# Altium project LimeNet-Micro_2v0.PrjPcb (part 7 of 9)

## Sheet 14_Clocks.SchDoc: Clocks
size A3; Organization: Lime Microsystems; Address1: Surrey Tech Centre; Address2: Guildford GU2 7YG; Address3: Surrey; Address4: United Kingdom; Revision: v2.0; SheetNumber: 14; SheetTotal: 15
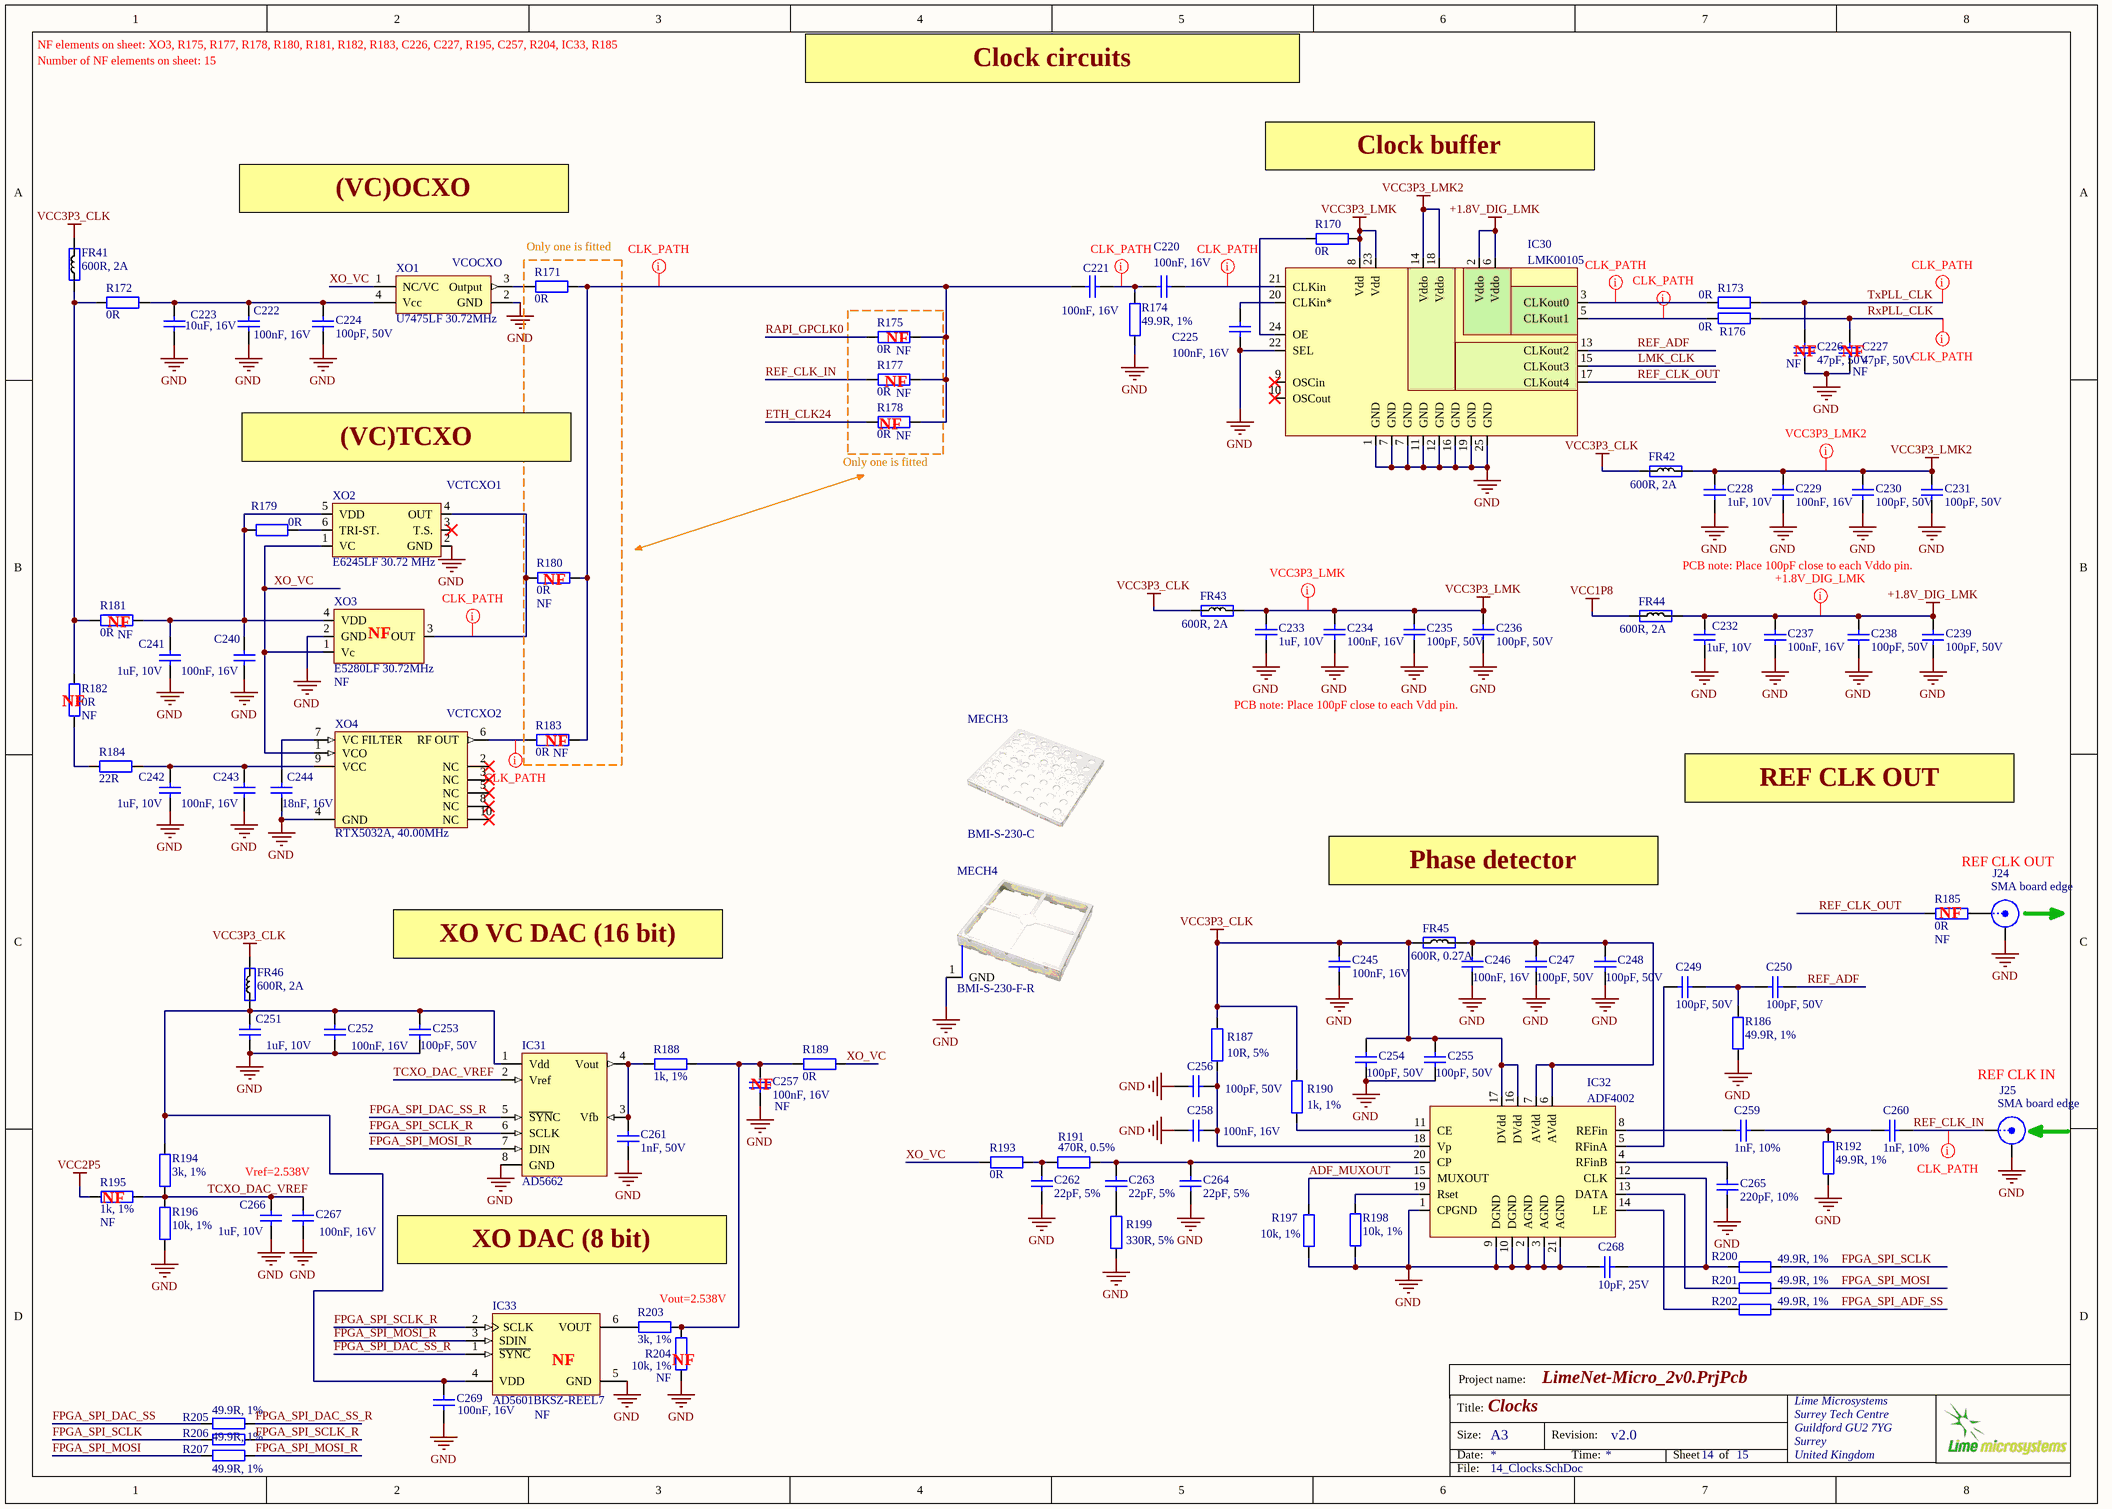
[diagram p13: 14_Clocks.SchDoc]

### Parts
C220  100nF, 16V  [CAP0402]
C221  100nF, 16V  [CAP0402]
C222  100nF, 16V  [CAP0402]
C223  10uF, 16V  [CAP0603]
C224  100pF, 50V  [CAP0402]
C225  100nF, 16V  [CAP0402]
C226  47pF, 50V  Assembly Info: NF  [CAP0402]
C227  47pF, 50V  Assembly Info: NF  [CAP0402]
C228  1uF, 10V  [CAP0402]
C229  100nF, 16V  [CAP0402]
C230  100pF, 50V  [CAP0402]
C231  100pF, 50V  [CAP0402]
C232  1uF, 10V  [CAP0402]
C233  1uF, 10V  [CAP0402]
C234  100nF, 16V  [CAP0402]
C235  100pF, 50V  [CAP0402]
C236  100pF, 50V  [CAP0402]
C237  100nF, 16V  [CAP0402]
C238  100pF, 50V  [CAP0402]
C239  100pF, 50V  [CAP0402]
C240  100nF, 16V  [CAP0402]
C241  1uF, 10V  [CAP0402]
C242  1uF, 10V  [CAP0402]
C243  100nF, 16V  [CAP0402]
C244  18nF, 16V  [CAP0402]
C245  100nF, 16V  [CAP0402]
C246  100nF, 16V  [CAP0402]
C247  100pF, 50V  [CAP0402]
C248  100pF, 50V  [CAP0402]
C249  100pF, 50V  [CAP0402]
C250  100pF, 50V  [CAP0402]
C251  1uF, 10V  [CAP0402]
C252  100nF, 16V  [CAP0402]
C253  100pF, 50V  [CAP0402]
C254  100pF, 50V  [CAP0402]
C255  100pF, 50V  [CAP0402]
C256  100pF, 50V  [CAP0402]
C257  100nF, 16V  Assembly Info: NF  [CAP0402]
C258  100nF, 16V  [CAP0402]
C259  1nF, 10%  [CAP0402]
C260  1nF, 10%  [CAP0402]
C261  1nF, 50V  [CAP0402]
C262  22pF, 5%  [CAP0402]
C263  22pF, 5%  [CAP0402]
C264  22pF, 5%  [CAP0402]
C265  220pF, 10%  [CAP0402]
C266  1uF, 10V  [CAP0402]
C267  100nF, 16V  [CAP0402]
C268  10pF, 25V  [CAP0402]
C269  100nF, 16V  [CAP0402]
FR41  600R, 2A  [RES0805]
FR42  600R, 2A  [RES0805]
FR43  600R, 2A  [RES0805]
FR44  600R, 2A  [RES0805]
FR45  600R, 0.27A  [RES0201]
FR46  600R, 2A  [RES0805]
IC30  LMK00105  [LMK00105SQ]
IC31  AD5662  [AD5662_SOT23-8]
IC32  ADF4002  [ADF4002]
IC33  AD5601BKSZ-REEL7  Assembly Info: NF  [AD5601_SOT23-6]
J24  SMA board edge  [SMA_connector_board_edge_SM]
J25  SMA board edge  [SMA_connector_board_edge_SM]
MECH3  BMI-S-230-C  (mechanical)
MECH4  BMI-S-230-F-R  [RFI_SHIELD_BMI-S-230-F-R]
R170  0R  [RES0402]
R171  0R  [RES0402_v2]
R172  0R  [RES0402]
R173  0R  [RES0402]
R174  49.9R, 1%  [RES0402]
R175  0R  Assembly Info: NF  [RES0402_v2]
R176  0R  [RES0402]
R177  0R  Assembly Info: NF  [RES0402_v2]
R178  0R  Assembly Info: NF  [RES0402_v2]
R179  0R  [RES0402]
R180  0R  Assembly Info: NF  [RES0402_v2]
R181  0R  Assembly Info: NF  [RES0402]
R182  0R  Assembly Info: NF  [RES0402]
R183  0R  Assembly Info: NF  [RES0402_v2]
R184  22R  [RES0402]
R185  0R  Assembly Info: NF  [RES0402]
R186  49.9R, 1%  [RES0402]
R187  10R, 5%  [RES0402]
R188  1k, 1%  [RES0402]
R189  0R  [RES0402]
R190  1k, 1%  [RES0402]
R191  470R, 0.5%  [RES0402]
R192  49.9R, 1%  [RES0402]
R193  0R  [RES0402]
R194  3k, 1%  [RES0402]
R195  1k, 1%  Assembly Info: NF  [RES0402]
R196  10k, 1%  [RES0402]
R197  10k, 1%  [RES0402]
R198  10k, 1%  [RES0402]
R199  330R, 5%  [RES0402]
R200  49.9R, 1%  [RES0402]
R201  49.9R, 1%  [RES0402]
R202  49.9R, 1%  [RES0402]
R203  3k, 1%  [RES0402]
R204  10k, 1%  Assembly Info: NF  [RES0402]
R205  49.9R, 1%  [RES0402]
R206  49.9R, 1%  [RES0402]
R207  49.9R, 1%  [RES0402]
XO1  U7475LF 30.72MHz  [AOCJYR-10.000MHz]
XO2  E6245LF 30.72 MHz  [RAKON_RPT7050A]
XO3  E5280LF 30.72MHz  Assembly Info: NF  [RAKON_TXCO]
XO4  RTX5032A, 40.00MHz  [RAKON_RTX5032A]

### Blocks framed on the sheet
Only one is fitted: R171 R180 R183

### Nets
+1.8V_DIG_LMK: C232.2 C237.2 C238.2 C239.2 FR44.2 IC30.2(Vddo) IC30.6(Vddo)
GND: C222.1 C223.1 C224.2 C225.1 C226.1 C227.1 C228.1 C229.1 C230.1 C231.1 C232.1 C233.1 C234.1 C235.1 C236.1 C237.1 C238.1 C239.1 C240.1 C241.1 C242.1 C243.1 C244.1 C245.1 C246.1 C247.2 C248.2 C251.1 C252.2 C253.2 C254.2 C255.2 C256.1 C257.1 C258.2 C261.2 C262.1 C264.1 C265.2 C266.1 C267.2 C268.1 C269.2 IC30.1(GND) IC30.7(GND) IC30.11(GND) IC30.12(GND) IC30.16(GND) IC30.19(GND) IC30.22(SEL) IC30.25(GND) IC31.8(GND) IC32.1(CPGND) IC32.2(AGND) IC32.3(AGND) IC32.9(DGND) IC32.10(DGND) IC32.21(AGND) IC33.5(GND) J24.2(Y) J25.2(Y) MECH4.1(GND) R174.1 R186.1 R192.1 R196.2 R197.2 R198.2 R199.1 R204.2 XO1.2(GND) XO2.2(GND) XO3.2(GND) XO4.4(GND)
VCC1P8: FR44.1
VCC2P5: R195.2
VCC3P3_CLK: C245.2 C254.1 C255.1 FR41.1 FR42.1 FR43.1 FR45.1 FR46.2 IC32.16(DVdd) IC32.17(DVdd) R187.2 R190.2
VCC3P3_LMK: C233.2 C234.2 C235.2 C236.2 FR43.2 IC30.8(Vdd) IC30.23(Vdd) R170.2
VCC3P3_LMK2: C228.2 C229.2 C230.2 C231.2 FR42.2 IC30.14(Vddo) IC30.18(Vddo)
ADF_MUXOUT: IC32.15(MUXOUT) R197.1
ETH_CLK24: R178.2
FPGA_SPI_ADF_SS: R202.1
FPGA_SPI_DAC_SS: R205.2
FPGA_SPI_DAC_SS_R: IC31.5(~{SYN}C) IC33.1(~{SYNC}) R205.1
FPGA_SPI_MOSI: R201.1 R207.2
FPGA_SPI_MOSI_R: IC31.7(DIN) IC33.3(SDIN) R207.1
FPGA_SPI_SCLK: R200.1 R206.2
FPGA_SPI_SCLK_R: IC31.6(SCLK) IC33.2(SCLK) R206.1
LMK_CLK: IC30.15(CLKout3)
RAPI_GPCLK0: R175.2
REF_ADF: C250.2 IC30.13(CLKout2)
REF_CLK_IN: C260.1 J25.1(X) R177.2
REF_CLK_OUT: IC30.17(CLKout4) R185.2
RxPLL_CLK: C227.2 R176.1
TCXO_DAC_VREF: C266.2 C267.1 IC31.2(Vref) R194.1 R195.1 R196.1
TxPLL_CLK: C226.2 R173.1
XO_VC: R189.1 R193.2 XO1.1(NC/VC) XO2.1(VC) XO3.1(Vc) XO4.1(VCO)
NetC220_1: C220.1 IC30.21(CLKin)
NetC220_2: C220.2 C221.1 R174.2
NetC221_2: C221.2 R171.1 R175.1 R177.1 R178.1 R180.1 R183.2
NetC222_2: C222.2 C223.2 C224.1 R172.2 XO1.4(Vcc)
NetC225_2: C225.2 IC30.20(CLKin*)
NetC240_2: C240.2 C241.2 R179.2 R181.1 XO2.5(VDD) XO3.4(VDD)
NetC242_2: C242.2 C243.2 R184.2 XO4.9(VCC)
NetC244_2: C244.2 XO4.7(VC_FILTER)
NetC246_2: C246.2 C247.1 C248.1 FR45.2 IC32.6(AVdd) IC32.7(AVdd)
NetC249_1: C249.1 IC32.5(RFinA)
NetC249_2: C249.2 C250.1 R186.2
NetC251_2: C251.2 C252.1 C253.1 C269.1 FR46.1 IC31.1(Vdd) IC33.4(VDD) R194.2
NetC256_2: C256.2 C258.1 IC32.18(Vp) R187.1
NetC257_2: C257.2 R188.1 R189.2 R203.1 R204.1
NetC259_1: C259.1 C260.2 R192.2
NetC259_2: C259.2 IC32.8(REFin)
NetC261_1: C261.1 IC31.3(Vfb) IC31.4(Vout) R188.2
NetC262_2: C262.2 R191.2 R193.1
NetC263_1: C263.1 R199.2
NetC263_2: C263.2 C264.2 IC32.20(CP) R191.1
NetC265_1: C265.1 IC32.4(RFinB)
NetC268_2: C268.2 IC32.12(CLK) R200.2
NetFR41_2: FR41.2 R172.1 R181.2 R182.1
NetIC30_3: IC30.3(CLKout0) R173.2
NetIC30_5: IC30.5(CLKout1) R176.2
NetIC30_24: IC30.24(OE) R170.1
NetIC32_11: IC32.11(CE) R190.1
NetIC32_13: IC32.13(DATA) R201.2
NetIC32_14: IC32.14(LE) R202.2
NetIC32_19: IC32.19(Rset) R198.1
NetIC33_6: IC33.6(VOUT) R203.2
NetJ24_1: J24.1(X) R185.1
NetR171_2: R171.2 XO1.3(Output)
NetR179_1: R179.1 XO2.6(TRI-ST.)
NetR180_2: R180.2 XO2.4(OUT) XO3.3(OUT)
NetR182_2: R182.2 R184.1
NetR183_1: R183.1 XO4.6(RF_OUT)

Not connected (* = marked no-connect by the designer): IC30 9(OSCin)* 10(OSCout)*; XO2 3(T.S.)*; XO4 2(NC)* 3(NC)* 5(NC)* 8(NC)* 10(NC)*

### Layout directives
net class CLK_PATH: NetC220_1, NetC220_2, NetC221_2, NetIC30_3, NetIC30_5, NetR180_2, NetR183_1, REF_CLK_IN, RxPLL_CLK, TxPLL_CLK
net class VCC3P3_LMK2: VCC3P3_LMK2
net class VCC3P3_LMK: VCC3P3_LMK
net class +1.8V_DIG_LMK: +1.8V_DIG_LMK

### Notes on the sheet
- NF elements on sheet: XO3, R175, R177, R178, R180, R181, R182, R183, C226, C227, R195, C257, R204, IC33, R185
- Number of NF elements on sheet: 15
- Clock circuits
- Clock buffer
- (VC)OCXO
- (near XO1) VCOCXO
- (near R175) NF
- (near C226) NF
- (near C227) NF
- (near R178) NF
- (near R177) NF
- (VC)TCXO
- (near XO2) VCTCXO1
- (near R178) Only one is fitted
- (near R180) NF
- PCB note: Place 100pF close to each Vddo pin.
- (near R181) NF
- (near XO3) NF
- (near R182) NF
- (near XO4) VCTCXO2
- PCB note: Place 100pF close to each Vdd pin.
- (near R183) NF
- REF CLK OUT
- Phase detector
- (near R185) NF
- XO VC DAC (16 bit)
- (near C257) NF
- (near J25) REF CLK IN
- Vref=2.538V
- (near R195) NF
- XO DAC (8 bit)
- Vout=2.538V
- (near IC33) NF
- (near R204) NF
- Project name:
- Title:
- Size:
- Date:
- A3
- Revision:
- Time:
- Sheet
- of
- File:

### Library data of the parts
C220-C222 C225 C229 C234 C237 C240 C243 C245 C246 C257 C258 = Cap_0402: Manufacturer: Murata Electronics; Manufacturer Part Number: GRM155R71C104KA88D; Part Description: CAP CER 0.1UF 16V X7R 0402; Tolerance: 10 %; Type: General Purpose MLCC; Capacitance: 0.1 uF; Case Length: 1 mm; Dielectric: X7R; Case Height: 0.5 mm; Temperature Coefficient / Code: +/- 15 %; Value: 100nF, 16V; Supplier 1: Mouser; Supplier Part Number 1: 81-GRM155R71C104KA88; Case Code - in: 0402; RoHS: RoHS Compliant; Operating Temperature Range: - 55 C to + 125 C; Series: GRM; Termination Style: SMD/SMT; Package / Case: 0402 (1005 metric); Voltage Rating DC: 16 V; Maximum Operating Temperature: + 125 C; Case Code - mm: 1005; Minimum Operating Temperature: - 55 C; Product Category: Low & Medium Capacitance SMD Ceramic Chip Capacitors; Packaging: Reel; Product: General Type MLCCs; Category: Multilayer Ceramic Capacitors MLCC - SMD/SMT; Brand: Murata Electronics; Case Width: 0.5 mm; RoHS - Mouser: Y; Standard Pack Qty: 10000; Minimum Order Quantity: 1; Reeling: True; Manufacturer Part Number 1: GRM155R71C104KA88D
C223 = Cap_0603: Manufacturer: Yageo; Manufacturer Part Number 1: GRM188R61C106MA73D; Part Description: 10µF ±20% 16V Ceramic Capacitor X5R 0603 (1608 Metric); Temperature Coefficient: X5R; Capacitance: 10µF; Tolerance: ±20%; Value: 10uF, 16V; Supplier 1: Digi-Key; Supplier Part Number 1: 490-7201-2-ND; Category: Capacitors; Ratings: -; Features: -; Lead Style: -; Package / Case: 0603 (1608 Metric); Lead Spacing: -; Applications: General Purpose; Voltage - Rated: 16V; Operating Temperature: -55°C ~ 85°C; Thickness (Max): 0.039" (1.00mm); Mounting Type: Surface Mount, MLCC; RoHS: RoHS Compliant; Size / Dimension: 0.063" L x 0.031" W (1.60mm x 0.80mm); Packaging: Tape & Reel (TR); Height - Seated (Max): -
C224 = Cap_0402: Manufacturer Part Number 1: CC0402JRNPO9BN101; Manufacturer: Yageo; Part Description: 100pF ±5% 50V C0G, NP0 Ceramic Capacitor -55°C ~ 125°C Surface Mount, MLCC 0402 (1005 Metric) 0.039" L x 0.020" W (1.00mm x 0.50mm); Tolerance: ±5%; Temperature Coefficient: C0G, NP0; Value: 100pF, 50V; Capacitance: 100pF; Thickness (Max): 0.022" (0.55mm); Size / Dimension: 0.039" L x 0.020" W (1.00mm x 0.50mm); RoHS: RoHS Compliant; Ratings: -; Package / Case: 0402 (1005 Metric); Mounting Type: Surface Mount, MLCC; Height - Seated (Max): -; Features: -; Lead Spacing: -; Voltage - Rated: 50V; Operating Temperature: -55°C ~ 125°C; Packaging: Cut Tape (CT); Applications: General Purpose; Lead Style: -; Supplier 1: Digi-Key; Category: Capacitors; Supplier Part Number 1: 311-1024-1-ND
C226 C227 = Cap_0402: Manufacturer Part Number 1: C1005C0G1H470F050BA; Manufacturer: TDK Corporation; Part Description: 47pF ±1% 50V C0G, NP0 Ceramic Capacitor -55°C ~ 125°C Surface Mount, MLCC 0402 (1005 Metric) 0.039" L x 0.020" W (1.00mm x 0.50mm); Temperature Coefficient: C0G, NP0; Tolerance: ±1%; Value: 47pF, 50V; Supplier 1: Digi-Key; Supplier Part Number 1: 445-5361-1-ND; Package / Case: 0402 (1005 Metric); Voltage - Rated: 50V; Lead Spacing: -; Ratings: -; Mounting Type: Surface Mount, MLCC; Operating Temperature: -55°C ~ 125°C; Thickness (Max): 0.022" (0.55mm); Capacitance: 47pF; Packaging: Cut Tape (CT); Features: -; Applications: General Purpose; Lead Style: -; Size / Dimension: 0.039" L x 0.020" W (1.00mm x 0.50mm); Height - Seated (Max): -; RoHS: RoHS Compliant; Category: Capacitors
C228 C232 C233 C241 C242 C251 C266 = Cap_0402: CAP CER 1UF 10V X5R 0402; Manufacturer: Yageo; Part Description: 1µF 10V Ceramic Capacitor X5R 0402 (1005 Metric) 0.039" L x 0.020" W (1.00mm x 0.50mm); Manufacturer Part Number: CC0402MRX5R6BB105; Notification: Current market demand for these product types have resulted in fluctuating and extending lead times. Lead times may differ.; Tolerance: ±20%; Value: 1uF, 10V; Supplier 1: Digi-Key; Supplier Part Number 1: 311-1732-1-ND; RoHS: RoHS Compliant; Applications: General Purpose; Category: Capacitors; ComponentLink1Description: http://www.yageo.com/documents/recent/UPY-GPHC_X5R_4V-to-50V_25.pdf; ComponentLink1URL: http://www.yageo.com/documents/recent/UPY-GPHC_X5R_4V-to-50V_25.pdf; Failure Rate: -; Features: -; Height - Seated (Max): -; Lead Spacing: -; Lead Style: -; Mounting Type: Surface Mount, MLCC; Operating Temperature: -55°C ~ 85°C; Package / Case: 0402 (1005 Metric); Packaging: Cut Tape (CT); Part Status: Active; Pricing 1: 1=0.22, 10=0.156, 100=0.0732, 500=0.0513, 1000=0.04248, 2500=0.03953, 5000=0.03617 (USD); Ratings: -; Size / Dimension: 0.039" L x 0.020" W (1.00mm x 0.50mm); Stock 1: 69600; Temperature Coefficient: X5R; Thickness (Max): 0.022" (0.55mm); Voltage - Rated: 10V
C230 C231 C235 C236 C238 C239 = Cap_0402: Manufacturer Part Number 1: CC0402JRNPO9BN101; Manufacturer: Yageo; Part Description: 100pF ±5% 50V C0G, NP0 Ceramic Capacitor -55°C ~ 125°C Surface Mount, MLCC 0402 (1005 Metric) 0.039" L x 0.020" W (1.00mm x 0.50mm); Temperature Coefficient: C0G, NP0; Tolerance: ±5%; Value: 100pF, 50V; Supplier 1: Digi-Key; Supplier Part Number 1: 311-1024-1-ND; RoHS: RoHS Compliant; Category: Capacitors; Applications: General Purpose; Mounting Type: Surface Mount, MLCC; Capacitance: 100pF; Ratings: -; Packaging: Cut Tape (CT); Voltage - Rated: 50V; Size / Dimension: 0.039" L x 0.020" W (1.00mm x 0.50mm); Height - Seated (Max): -; Package / Case: 0402 (1005 Metric); Operating Temperature: -55°C ~ 125°C; Features: -; Lead Spacing: -; Lead Style: -; Thickness (Max): 0.022" (0.55mm)
C244 = Cap_0402: Manufacturer: Yageo; Manufacturer Part Number 1: CC0402KRX7R7BB183; Part Description: 0.018µF ±10% 16V Ceramic Capacitor X7R 0402 (1005 Metric); Temperature Coefficient: X7R; Capacitance: 0.018µF; Tolerance: ±10%; Value: 18nF, 16V; Supplier 1: Digi-Key; Supplier Part Number 1: 311-1706-1-ND; Part Status: Active; Category: Capacitors; Packaging: Cut Tape (CT); Voltage - Rated: 16V; RoHS: RoHS Compliant; Size / Dimension: 0.039" L x 0.020" W (1.00mm x 0.50mm); Package / Case: 0402 (1005 Metric); Mounting Type: Surface Mount, MLCC; Thickness (Max): 0.022" (0.55mm); Applications: General Purpose; Operating Temperature: -55°C ~ 125°C
C247-C250 C253-C256 = Cap_0402: Manufacturer: Yageo; Manufacturer Part Number 1: CC0402JRNPO9BN101; Part Description: 100pF ±5% 50V C0G, NP0 Ceramic Capacitor -55°C ~ 125°C Surface Mount, MLCC 0402 (1005 Metric) 0.039" L x 0.020" W (1.00mm x 0.50mm); Temperature Coefficient: C0G, NP0; Tolerance: ±5%; Value: 100pF, 50V; Supplier 1: Digi-Key; Supplier Part Number 1: 311-1024-1-ND; Category: Capacitors; Features: -; Operating Temperature: -55°C ~ 125°C; Capacitance: 100pF; Thickness (Max): 0.022" (0.55mm); RoHS: RoHS Compliant; Voltage - Rated: 50V; Lead Style: -; Ratings: -; Size / Dimension: 0.039" L x 0.020" W (1.00mm x 0.50mm); Height - Seated (Max): -; Applications: General Purpose; Package / Case: 0402 (1005 Metric); Lead Spacing: -; Packaging: Cut Tape (CT); Mounting Type: Surface Mount, MLCC
C252 C267 = Cap_0603: Manufacturer Part Number 1: GRM155R71C104KA88D; Part Description: CAP CER 0.1UF 16V X7R 0402; Brand: Murata Electronics; Tolerance: 10 %; Type: General Purpose MLCC; Capacitance: 0.1 uF; Temperature Coefficient / Code: +/- 15 %; Case Height: 0.5 mm; Case Length: 1 mm; Dielectric: X7R; Supplier 1: Mouser; Supplier Part Number 1: 81-GRM155R71C104KA88; Case Code - in: 0402; Manufacturer: Murata Electronics; Category: Multilayer Ceramic Capacitors MLCC - SMD/SMT; Voltage Rating DC: 16 V; Value: 100nF, 16V; Manufacturer Part Number: GRM155R71C104KA88D; Case Code - mm: 1005; Case Width: 0.5 mm; Maximum Operating Temperature: + 125 C; Minimum Operating Temperature: - 55 C; Minimum Order Quantity: 1; Operating Temperature Range: - 55 C to + 125 C; Package / Case: 0402 (1005 metric); Packaging: Reel; Product: General Type MLCCs; Product Category: Low & Medium Capacitance SMD Ceramic Chip Capacitors; Reeling: True; RoHS - Mouser: Y; RoHS: RoHS Compliant; Series: GRM; Standard Pack Qty: 10000; Termination Style: SMD/SMT
C259 C260 = Cap_0402: Manufacturer Part Number 1: GCM155R71H102KA37D; Part Description: 1000pF ±10% 50V X7R Ceramic Capacitor -55°C ~ 125°C Surface Mount, MLCC 0402 (1005 Metric) 0.039" L x 0.020" W (1.00mm x 0.50mm); Capacitance: 1000 pF; Type: Automotive Ultra Small MLCC; Brand: Murata Electronics; Case Height: 0.5 mm; Case Length: 1 mm; Dielectric: X7R; Voltage Rating DC: 50 V; Temperature Coefficient / Code: +/- 15 %; Value: 1nF, 10%; Supplier 1: Mouser; Supplier Part Number 1: 81-GCM155R71H102KA7D; Case Code - in: 0402; Package / Case: 0402 (1005 metric); Tolerance: 10 %; Termination Style: SMD/SMT; Packaging: Reel; Operating Temperature Range: - 55 C to + 125 C; Maximum Operating Temperature: + 125 C; Manufacturer: Murata Electronics; Category: Multilayer Ceramic Capacitors MLCC - SMD/SMT; RoHS: RoHS Compliant; Series: GCM; Case Width: 0.5 mm; Case Code - mm: 1005; Product: Automotive MLCCs; Standard Pack Qty: 10000; Reeling: True; RoHS - Mouser: Y; Minimum Order Quantity: 1; Product Category: Automotive Ceramic Chip Capacitors; Minimum Operating Temperature: - 55 C
C261 = Cap_0402: Manufacturer: Murata Electronics North America; Part Description: 1000pF ±10% 50V Ceramic Capacitor X7R 0402 (1005 Metric); Manufacturer Part Number 1: GCM155R71H102KA37D; Temperature Coefficient: X7R; Tolerance: ±10%; Height - Seated (Max): -; Operating Temperature: -55°C ~ 125°C; Ratings: AEC-Q200; Package / Case: 0402 (1005 Metric); Lead Style: -; Size / Dimension: 0.039" L x 0.020" W (1.00mm x 0.50mm); Lead Spacing: -; Thickness (Max): 0.022" (0.55mm); Mounting Type: Surface Mount, MLCC; Features: -; Voltage - Rated: 50V; Applications: Automotive; Part Status: Active; Packaging: Cut Tape (CT); RoHS: RoHS Compliant; Category: Capacitors; Supplier Part Number 1: 490-4761-1-ND; Supplier 1: Digi-Key; Value: 1nF, 50V
C262-C264 = Cap_0402: Manufacturer: Yageo; Manufacturer Part Number 1: CC0402JRNPO9BN220; Part Description: 22pF ±5% 50V C0G, NP0 Ceramic Capacitor -55°C ~ 125°C Surface Mount, MLCC 0402 (1005 Metric) 0.039" L x 0.020" W (1.00mm x 0.50mm); Voltage - Rated: 50V; Temperature Coefficient: C0G, NP0; Value: 22pF, 5%; Supplier 1: Digi-Key; Supplier Part Number 1: 311-1018-2-ND; Tolerance: ±5%; Category: Capacitors; Packaging: Tape & Reel (TR); RoHS: RoHS Compliant; Capacitance: 22pF; Operating Temperature: -55°C ~ 125°C; Mounting Type: Surface Mount, MLCC; Height - Seated (Max): -; Size / Dimension: 0.039" L x 0.020" W (1.00mm x 0.50mm); Ratings: -; Applications: General Purpose; Thickness (Max): 0.022" (0.55mm); Lead Spacing: -; Lead Style: -; Features: -; Package / Case: 0402 (1005 Metric)
C265 = Cap_0402: Manufacturer Part Number 1: CC0402KRX7R9BB221; Manufacturer: Yageo; Part Description: 220pF ±10% 50V X7R Ceramic Capacitor -55°C ~ 125°C Surface Mount, MLCC 0402 (1005 Metric) 0.039" L x 0.020" W (1.00mm x 0.50mm); Temperature Coefficient: X7R; Voltage - Rated: 50V; Value: 220pF, 10%; Supplier 1: Digi-Key; Supplier Part Number 1: 311-1035-2-ND; Category: Capacitors; Ratings: -; RoHS: RoHS Compliant; Packaging: Tape & Reel (TR); Mounting Type: Surface Mount, MLCC; Applications: General Purpose; Capacitance: 220pF; Tolerance: ±10%; Operating Temperature: -55°C ~ 125°C; Package / Case: 0402 (1005 Metric); Lead Spacing: -; Size / Dimension: 0.039" L x 0.020" W (1.00mm x 0.50mm); Thickness (Max): 0.022" (0.55mm); Height - Seated (Max): -; Lead Style: -; Features: -
C268 = Cap_0402: Manufacturer Part Number 1: 04023A100JAT2A; Manufacturer: AVX; Part Description: 10pF ±5% 25V C0G, NP0 Ceramic Capacitor -55°C ~ 125°C Surface Mount, MLCC 0402 (1005 Metric) 0.039" L x 0.020" W (1.00mm x 0.50mm); Capacitance Tolerance: ± 5%; Voltage Rating: 25; Ceramic Capacitor Case: 0402 [1005 Metric]; Capacitor Case Style: 0402 [1005 Metric]<!--FANDB--><div class="features-and-benefits-container"></div>; Dielectric Characteristic: C0G / NP0; SVHC: No SVHC (16-Jun-2014); Capacitance: 10; Value: 10pF, 25V; Supplier 1: Farnell; Supplier Part Number 1: 2332478RL; Product Range: -; RoHS: YES; Operating Temperature Min: -55; Operating Temperature Max: 125; Capacitance Tolerance ±: ± 5%; MSL: MSL 1 - Unlimited; Packaging: Cut Tape
C269 = Cap_0603: as C198 on sheet 13_Raspberry_Misc; Supplier 1: Mouser; Supplier Part Number 1: 81-GRM155R71C104KA88; Case Code - in: 0402; Manufacturer: Murata Electronics; Category: Multilayer Ceramic Capacitors MLCC - SMD/SMT; Voltage Rating DC: 16 V; Value: 100nF, 16V; Manufacturer Part Number: GRM155R71C104KA88D
FR41 = Ferrite: Manufacturer Part Number 1: MPZ2012S601AT000; Manufacturer: TDK Corporation; Part Description: FERRITE BEAD 600 OHM 0805 1LN; DC Resistance (DCR): 100 mOhm Max; Filter Type: Differential Mode - Single; Impedance @ Frequency: 600 Ohm @ 100MHz; Supplier 1: Digi-Key; Supplier Part Number 1: 445-2206-2-ND; Value: 600R, 2A; Category: Filters; Current Rating: 2A; Height (Max): 0.041" (1.05mm); Mounting Type: Surface Mount; Package / Case: 0805 (2012 Metric); Packaging: Tape & Reel (TR); RoHS: RoHS Compliant; Size / Dimension: 0.079" L x 0.049" W (2.00mm x 1.25mm)
FR42-FR44 FR46 = Ferrite: Manufacturer Part Number 1: MPZ2012S601AT000; Manufacturer: TDK Corporation; Part Description: FERRITE BEAD 600 OHM 0805 1LN; Filter Type: Differential Mode - Single; Impedance @ Frequency: 600 Ohm @ 100MHz; DC Resistance (DCR): 100 mOhm Max; Supplier 1: Digi-Key; Supplier Part Number 1: 445-2206-2-ND; Mounting Type: Surface Mount; RoHS: RoHS Compliant; Height (Max): 0.041" (1.05mm); Packaging: Tape & Reel (TR); Category: Filters; Current Rating: 2A; Package / Case: 0805 (2012 Metric); Size / Dimension: 0.079" L x 0.049" W (2.00mm x 1.25mm); Value: 600R, 2A
FR45 = Ferrite: Manufacturer Part Number 1: BK0603TS601-T; Manufacturer: Taiyo Yuden; Part Description: FERRITE BEAD 600 OHM 0201 1LN; DC Resistance (DCR): 750 mOhm Max; Filter Type: Differential Mode - Single; Impedance @ Frequency: 600 Ohm @ 100MHz; Current Rating: 270mA; Supplier 1: Digi-Key; Supplier Part Number 1: 587-3277-1-ND; Size / Dimension: 0.024" L x 0.012" W (0.60mm x 0.30mm); Package / Case: 0201 (0603 Metric); Height (Max): 0.013" (0.33mm); Mounting Type: Surface Mount; Packaging: Cut Tape (CT); RoHS: RoHS Compliant; Category: Filters; Value: 600R, 0.27A
IC30 = LMK00105: Manufacturer: Texas Instruments; Manufacturer Part Number 1: LMK00105SQ/NOPB; Part Description: IC CLK BUFFER 2:5 200MHZ 24WQFN; Frequency - Max: 200MHz; Voltage - Supply: 2.375 V ~ 3.45 V; Input: HCSL, LVCMOS, LVDS, LVPECL, LVTTL, SSTL, Crystal; Differential - Input:Output: Yes/No; Supplier 1: Digi-Key; Type: Fanout Buffer (Distribution), Multiplexer, Translator; Category: Integrated Circuits (ICs); Operating Temperature: -40°C ~ 85°C; Package / Case: 24-WFQFN Exposed Pad; Supplier Device Package: 24-WQFN (4x4); Supplier Part Number 1: LMK00105SQ/NOPBCT-ND
IC31 = AD5662: Manufacturer: Analog Devices Inc.; Manufacturer Part Number 1: AD5662BRJZ-2REEL7; Part Description: IC DAC 16BIT BUFF V-OUT SOT23-8; Number of Bits: 16; Number of D/A Converters: 1; Settling Time: 10µs; Output Type: Voltage - Buffered; Differential Output: No; Data Interface: SPI, DSP; Reference Type: External; Voltage - Supply, Analog: 2.7 V ~ 5.5 V; INL/DNL (LSB): ±8, ±1 (Max); Architecture: String DAC; Supplier 1: Digi-Key; RoHS: RoHS Compliant; Category: Integrated Circuits (ICs); Stock 1: 2784; Pricing 1: 1=7.55, 10=6.821, 100=5.6469, 500=4.91722, 1000=4.28274 (USD); Packaging: Cut Tape (CT); Part Status: Active; Voltage - Supply, Digital: 2.7 V ~ 5.5 V; Operating Temperature: -40°C ~ 125°C; Package / Case: SOT-23-8; Supplier Device Package: SOT-23-8; ComponentLink1URL: http://www.analog.com/media/en/technical-documentation/data-sheets/AD5662.pdf; ComponentLink1Description: http://www.analog.com/media/en/technical-documentation/data-sheets/AD5662.pdf; Supplier Part Number 1: AD5662BRJZ-2REEL7CT-ND
IC32 = ADF4002: Manufacturer: Analog Devices Inc; Manufacturer Part Number 1: ADF4002BCPZ-RL7; Part Description: IC PLL FREQUENCY SYNTH 20-LFCSP; Ratio - Input:Output: 2:1; Differential - Input:Output: Yes/No; Input: CMOS, TTL; Voltage - Supply: 2.7 V ~ 3.3 V; Supplier 1: Digi-Key; Supplier: Digi-Key; Category: Integrated Circuits (ICs); Type: Clock/Frequency Synthesizer (RF), Phase Detector; Operating Temperature: -40°C ~ 85°C; Mounting Type: Surface Mount; Package / Case: 20-VFQFN Exposed Pad, CSP; Supplier Part Number 1: ADF4002BCPZ-RL7CT-ND
IC33 = AD5601BKSZ-REEL7: Single 8-Bit nanoDAC with SPI Interface in LFCSP and SC70, 2.7 to 5.5 V, <100 uA, -40 to +125 degC, KS-6, Pb-Free, Reel; Generic Part Number: AD5601; Manufacturer: Analog Devices; Part Description: IC DAC 8BIT BUFF V-OUT SC70-6; # DAC Outputs: 1; Max V+: 5.5V; Op Pwr Diss: 550µW; Resolution (Bits): 8; Settling Time: 6µs; Single Supply: Yes; DatasheetVersion: Rev.F; PackageVersion: 072809-A; PackageReference: KS-6; PackageDescription: 6-Lead Thin Shrink Small Outline Transistor Package [SC70]; Supplier 1: Digi-Key; Supplier Part Number 1: AD5601BKSZ-REEL7TR-ND; Supplier 2: Digi-Key; Supplier Part Number 2: AD5601BKSZ-REEL7CT-ND; Supplier 3: Digi-Key; Supplier Part Number 3: AD5601BKSZ-REEL7DKR-ND; Supplier 4: Farnell; Supplier Part Number 4: 2312971; Supplier 5: Newark; Supplier Part Number 5: 59K4256; Supplier 6: Newark; Supplier Part Number 6: 67W3160; Supplier 7: Mouser; Supplier Part Number 7: 584-AD5601BKSZ-R7; Packing: Reel; RoHS: Y; Mounting Technology: Surface Mount; Code_JEDEC: MO-203-AB; PartNumber: AD5601BKSZ-REEL7; ComponentLink1Description: Manufacturer URL; ComponentLink1URL: http://www.analog.com/en/index.html; ComponentLink2Description: Datasheet; ComponentLink2URL: http://www.analog.com/static/imported-files/data_sheets/AD5601_5611_5621.pdf; ComponentLink3Description: Package Specification; ComponentLink3URL: http://www.analog.com/static/imported-files/packages/PKG_PDF/SC70(KS)/KS_6.pdf; ComponentLink4Description: Product URL; ComponentLink4URL: http://www.analog.com/en/digital-to-analog-converters/da-converters/ad5601/products/product.html
J24 J25 = RF_IF_connector: CONN SMA JACK STR 50OHM EDGE MNT; Manufacturer: RF Solutions; Manufacturer Part Number 1: CON-SMA-EDGE-S; Part Description: SMA Connector Jack, Female Socket Board Edge, End Launch Solder; Connector Type: Jack, Female Socket; Contact Termination: Solder; Supplier 1: Digi-Key; Supplier Part Number 1: CON-SMA-EDGE-S-ND; RoHS: RoHS Compliant; Category: Connectors, Interconnects; Stock 1: 1751; Pricing 1: 1=2.1 (USD); Packaging: -; Part Status: Active; Connector Style: SMA; Shield Termination: Solder; Impedance: -; Mounting Type: Board Edge, End Launch; Mounting Feature: -; Cable Group: -; Fastening Type: Threaded; Frequency - Max: -; Features: -; Housing Color: -; Ingress Protection: -; Includes: -; Body Material: -; Body Finish: -; Center Contact Plating: -; Dielectric Material: -; Operating Temperature: -; Center Contact Material: -; Voltage Rating: -; Mating Cycles: -; Insertion Loss: -; ComponentLink1URL: http://media.digikey.com/pdf/Data%20Sheets/RF%20Solutions%20PDFs/CON-SMA-EDGE.pdf; ComponentLink1Description: http://media.digikey.com/pdf/Data%20Sheets/RF%20Solutions%20PDFs/CON-SMA-EDGE.pdf
MECH3 = RFI_SHIELD_2_cover: Part Description: RF Shield Cover 2.000" (50.80mm) X 1.500" (38.10mm) Vent Holes in Pattern Snap Fit; Manufacturer: Laird Technologies EMI; Ventilation: Vent Holes in Pattern; Supplier 1: Digi-Key; Supplier Part Number 1: 903-1471-ND; Manufacturer Part Number 1: BMI-S-230-C; RoHS: RoHS Compliant; Category: RF/IF and RFID; Stock 1: 15865; Pricing 1: 1=1.51, 10=1.333, 25=1.2044, 100=1.0537, 250=0.92472, 500=0.8172, 1000=0.64515, 2500=0.60214, 5000=0.57203 (USD); Packaging: Bulk; Part Status: Active; Type: Cover; Height - Overall: 0.200" (5.08mm); Length - Overall: 1.500" (38.10mm); Width - Overall: 2.000" (50.80mm); Mounting Type: Snap Fit; ComponentLink1URL: https://media.digikey.com/pdf/Data%20Sheets/Laird%20Technologies/BMI-S-230-C_Dwg.pdf; ComponentLink1Description: https://media.digikey.com/pdf/Data%20Sheets/Laird%20Technologies/BMI-S-230-C_Dwg.pdf
MECH4 = RFI_SHIELD_2_frame: Part Description: RF Shield Frame 2.000" (50.80mm) X 1.500" (38.10mm) Solder; Manufacturer: Laird Technologies EMI; Supplier 1: Digi-Key; Supplier Part Number 1: 903-1470-1-ND; Manufacturer Part Number 1: BMI-S-230-F-R; RoHS: RoHS Compliant; Category: RF/IF and RFID; Stock 1: 12638; Pricing 1: 1=1.95, 10=1.726, 25=1.5588 (USD); Packaging: Cut Tape (CT); Part Status: Active; Type: Frame; Height - Overall: 0.200" (5.08mm); Length - Overall: 1.500" (38.10mm); Width - Overall: 2.000" (50.80mm); Ventilation: -; Mounting Type: Solder; ComponentLink1URL: https://media.digikey.com/pdf/Data%20Sheets/Laird%20Technologies/BMI-S-230-F_Dwg.pdf; ComponentLink1Description: https://media.digikey.com/pdf/Data%20Sheets/Laird%20Technologies/BMI-S-230-F_Dwg.pdf
R170-R173 R175-R183 R185 R189 R193 = Res_0402: Manufacturer Part Number 1: RC0402JR-070RL; Manufacturer: Yageo; Part Description: RES SMD 0.0OHM JUMPER 1/16W 0402; Resistance (Ohms): 0.0; Tolerance: Jumper; Power (Watts): 0.063W, 1/16W; Value: 0R; Supplier 1: Digi-Key; Supplier Part Number 1: 311-0.0JRTR-ND; Category: Resistors; Temperature Coefficient: -; Features: Moisture Resistant; Supplier Device Package: 0402; Height: 0.016" (0.40mm); Package / Case: 0402 (1005 Metric); Operating Temperature: -55°C ~ 155°C; Size / Dimension: 0.039" L x 0.020" W (1.00mm x 0.50mm); Composition: Thick Film; Packaging: Tape & Reel (TR); Number of Terminations: 2; RoHS: RoHS Compliant
R174 R186 R192 R200-R202 = Res_0402: Manufacturer: Samsung Electro-Mechanics America, Inc.; Manufacturer Part Number: RC1005F49R9CS; Part Description: RES SMD 49.9 OHM 1% 1/16W 0402; Temperature Coefficient: ±100ppm/°C; Resistance (Ohms): 49.9; Power (Watts): 0.063W, 1/16W; Number of Terminations: 2; Size / Dimension: 0.039" L x 0.020" W (1.00mm x 0.50mm); Supplier Device Package: 0402 (1005 Metric); RoHS: RoHS Compliant; Supplier Part Number 1: 1276-3469-6-ND; Features: -; Packaging: Digi-Reel®; Tolerance: ±1%; Height: 0.016" (0.40mm); Category: Resistors; Composition: Thick Film; Package / Case: 0402 (1005 Metric); Supplier 1: Digi-Key; Operating Temperature: -55°C ~ 155°C; Value: 49.9R, 1%
R184 = Res_0402: Part Description: RES SMD 22 OHM 1% 1/16W 0402; Manufacturer Part Number 1: RC0402FR-0722RL; Manufacturer: Yageo; Tolerance: ±1%; Temperature Coefficient: ±100ppm/°C; Resistance (Ohms): 22; Supplier 1: Digi-Key; Supplier Part Number 1: 311-22.0LRTR-ND; Supplier Device Package: 0402; Composition: Thick Film; Category: Resistors; Value: 22R
R187 = Res_0402: Manufacturer Part Number 1: RC0402JR-0710RL; Manufacturer: Yageo; Part Description: RES SMD 10 OHM 5% 1/16W 0402; Power (Watts): 0.063W, 1/16W; Resistance (Ohms): 10; Temperature Coefficient: ±200ppm/°C; Value: 10R, 5%; Supplier 1: Digi-Key; Supplier Part Number 1: 311-10JRTR-ND; Number of Terminations: 2; Height: 0.016" (0.40mm); RoHS: RoHS Compliant; Composition: Thick Film; Packaging: Tape & Reel (TR); Category: Resistors; Supplier Device Package: 0402; Features: Moisture Resistant; Tolerance: ±5%; Operating Temperature: -55°C ~ 155°C; Size / Dimension: 0.039" L x 0.020" W (1.00mm x 0.50mm); Package / Case: 0402 (1005 Metric)
R188 R190 R195 = Res_0402: Manufacturer: Stackpole Electronics Inc; Manufacturer Part Number 1: RMCF0402FT1K00; Part Description: RES SMD 1K OHM 1% 1/16W 0402; Temperature Coefficient: ±100ppm/°C; Power (Watts): 0.063W, 1/16W; Value: 1k, 1%; Supplier 1: Digi-Key; Supplier Part Number 1: RMCF0402FT1K00TR-ND; Resistance (Ohms): 1k; Packaging: Tape & Reel (TR); Category: Resistors; RoHS: RoHS Compliant; Tolerance: ±1%; Height: 0.016" (0.40mm); Number of Terminations: 2; Package / Case: 0402 (1005 Metric); Operating Temperature: -55°C ~ 155°C; Features: -; Composition: Thick Film; Supplier Device Package: 0402; Size / Dimension: 0.039" L x 0.020" W (1.00mm x 0.50mm)
R191 = Res_0402: Manufacturer: Panasonic Electronic Components; Manufacturer Part Number 1: ERA-2AED471X; Part Description: RES SMD 470 OHM 0.5% 1/16W 0402; Power (Watts): 0.063W, 1/16W; Temperature Coefficient: ±25ppm/°C; Resistance (Ohms): 470; Value: 470R, 0.5%; Supplier 1: Digi-Key; Supplier Part Number 1: P470DETR-ND; Tolerance: ±0.5%; Packaging: Tape & Reel (TR); Number of Terminations: 2; Operating Temperature: -55°C ~ 155°C; RoHS: RoHS Compliant; Size / Dimension: 0.039" L x 0.020" W (1.00mm x 0.50mm); Composition: Thin Film; Package / Case: 0402 (1005 Metric); Height: 0.016" (0.40mm); Features: Automotive AEC-Q200; Supplier Device Package: 0402; Category: Resistors
R194 R203 = Res_0402: Manufacturer: Vishay Dale; Part Description: RES SMD 3K OHM 1% 1/16W 0402; Manufacturer Part Number 1: CRCW04023K00FKED; Temperature Coefficient: ±100ppm/°C; Power (Watts): 0.063W, 1/16W; Value: 3k, 1%; Category: Resistors; Tolerance: ±1%; RoHS: RoHS Compliant; Composition: Thick Film; Number of Terminations: 2; Operating Temperature: -55°C ~ 155°C; Supplier Device Package: 0402 (1005 Metric); Supplier Part Number 1: 541-3.00KLCT-ND; Packaging: Cut Tape (CT); Supplier 1: Digi-Key; Package / Case: 0402 (1005 Metric); Features: Automotive AEC-Q200; Resistance (Ohms): 3k; Height: 0.016" (0.40mm); Size / Dimension: 0.039" L x 0.020" W (1.00mm x 0.50mm)
R196-R198 R204 = Res_0402: Manufacturer: Yageo; Manufacturer Part Number 1: RC0402FR-0710KL; Part Description: RES SMD 10K OHM 1% 1/16W 0402; Temperature Coefficient: ±100ppm/°C; Power (Watts): 0.063W, 1/16W; Value: 10k, 1%; Supplier 1: Digi-Key; Supplier Part Number 1: 311-10.0KLRTR-ND; Resistance (Ohms): 10k; Packaging: Tape & Reel (TR); RoHS: RoHS Compliant; Package / Case: 0402 (1005 Metric); Tolerance: ±1%; Operating Temperature: -55°C ~ 155°C; Size / Dimension: 0.039" L x 0.020" W (1.00mm x 0.50mm); Number of Terminations: 2; Category: Resistors; Height: 0.016" (0.40mm); Supplier Device Package: 0402; Features: Moisture Resistant; Composition: Thick Film
R199 = Res_0402: Manufacturer: Yageo; Manufacturer Part Number 1: RC0402JR-07330RL; Part Description: RES SMD 330 OHM 5% 1/16W 0402; Power (Watts): 0.063W, 1/16W; Resistance (Ohms): 330; Temperature Coefficient: ±100ppm/°C; Value: 330R, 5%; Supplier 1: Digi-Key; Supplier Part Number 1: 311-330JRTR-ND; Composition: Thick Film; Supplier Device Package: 0402; Package / Case: 0402 (1005 Metric); Size / Dimension: 0.039" L x 0.020" W (1.00mm x 0.50mm); Features: Moisture Resistant; Height: 0.016" (0.40mm); Packaging: Tape & Reel (TR); RoHS: RoHS Compliant; Tolerance: ±5%; Category: Resistors; Number of Terminations: 2; Operating Temperature: -55°C ~ 155°C
R205-R207 = Res_0402: Manufacturer: Samsung Electro-Mechanics America, Inc.; Part Description: RES SMD 49.9 OHM 1% 1/16W 0402; Manufacturer Part Number 1: RC1005F49R9CS; Temperature Coefficient: ±100ppm/°C; Resistance (Ohms): 49.9; Power (Watts): 0.063W, 1/16W; Number of Terminations: 2; Size / Dimension: 0.039" L x 0.020" W (1.00mm x 0.50mm); Supplier Device Package: 0402 (1005 Metric); RoHS: RoHS Compliant; Supplier Part Number 1: 1276-3469-6-ND; Features: -; Packaging: Digi-Reel®; Tolerance: ±1%; Height: 0.016" (0.40mm); Category: Resistors; Composition: Thick Film; Package / Case: 0402 (1005 Metric); Supplier 1: Digi-Key; Operating Temperature: -55°C ~ 155°C; Value: 49.9R, 1%
XO1 = AOCJYR-10.000MHz: Manufacturer: Rakon; Part Description: ROM9070SA 30.72MHz MERC+ 9x7 HOT RC2.5 3.3V PULL; Oscillator Output Compatibility: CMOS; Oscillator Case: SMD, 9.7mm x 7.5; Supply Voltage Nom: 3.3; Frequency Nom, MHz: 30.72; Frequency Stability +/-, ppb: 20; Manufacturer Part Number 1: U7475LF 30.72MHz; Supplier Part Number 1: U7475LF; Supplier 1: Rakon
XO2 = RPT7050A: Part Description: TCXO 30.72MHz, E6245LF; Manufacturer: Rakon; Manufacturer Part Number 1: E6245LF; Supplier 1: Rakon; Supplier Part Number 1: E6245LF
XO3 = TXCO: Part Description: TCXO 30.72MHz, E5280LF; Manufacturer: Rakon; Manufacturer Part Number 1: E5280LF; Supplier 1: Rakon; Supplier Part Number 1: E5280LF
XO4 = Rakon_RTX5032A: Part Description: RTX5032A 40MHz, High performance TCXO, With VC, Filter Enabled, 10-pin 5mm x 3.2 mm x 1.65 mm package; Manufacturer: Rakon; Manufacturer Part Number 1: RTX5032A; Supplier Part Number 1: RTX5032A; Supplier 1: RAKON

## Sheet 15_PowerSupply.SchDoc: Board power supply
size A3; Organization: Lime Microsystems; Address1: Surrey Tech Centre; Address2: Guildford GU2 7YG; Address3: Surrey; Address4: United Kingdom; Revision: v2.0; SheetNumber: 15; SheetTotal: 15
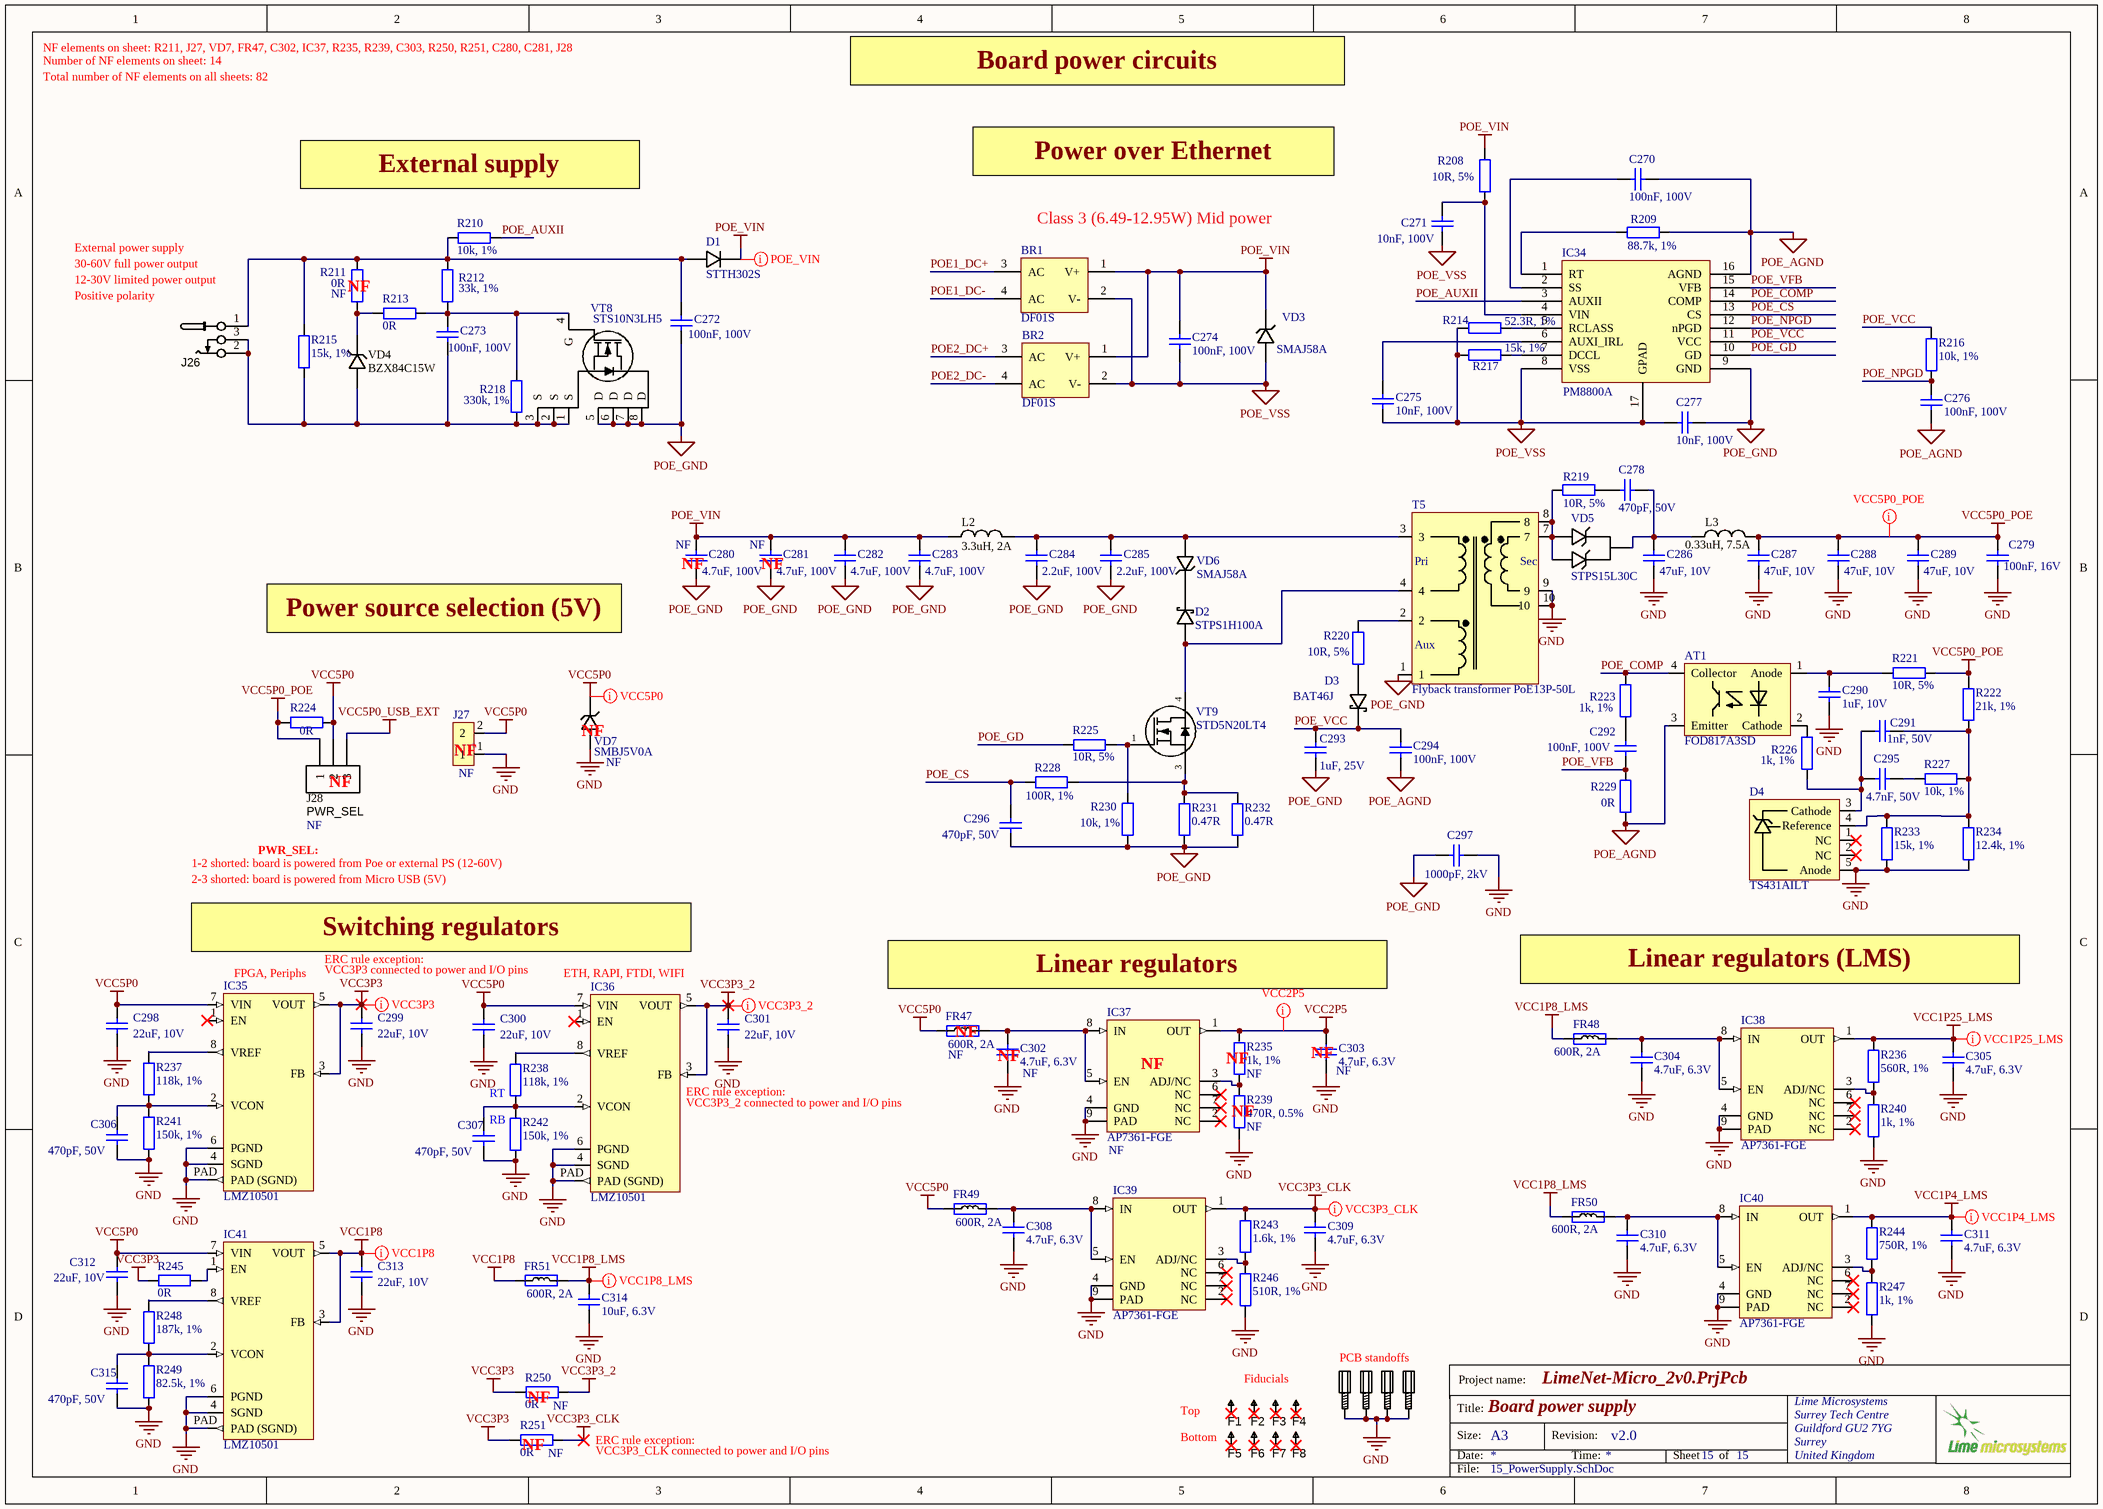
[diagram p14: 15_PowerSupply.SchDoc]

### Parts
AT1  FOD817A3SD  [FOD817A3SD_optoisolator_FOD817]
BR1  DF01S  [DF01S-T_RECTIFIER_BRIDGE_v1]
BR2  DF01S  [DF01S-T_RECTIFIER_BRIDGE_v1]
C270  100nF, 100V  [CAP0805]
C271  10nF, 100V  [CAP0603]
C272  100nF, 100V  [CAP0805]
C273  100nF, 100V  [CAP0805]
C274  100nF, 100V  [CAP0805]
C275  10nF, 100V  [CAP0603]
C276  100nF, 100V  [CAP0805]
C277  10nF, 100V  [CAP0603]
C278  470pF, 50V  [CAP0402]
C279  100nF, 16V  [CAP0402]
C280  4.7uF, 100V  Assembly Info: NF  [CAP1210]
C281  4.7uF, 100V  Assembly Info: NF  [CAP1210]
C282  4.7uF, 100V  [CAP1210]
C283  4.7uF, 100V  [CAP1210]
C284  2.2uF, 100V  [CAP1206]
C285  2.2uF, 100V  [CAP1206]
C286  47uF, 10V  [CAP1206]
C287  47uF, 10V  [CAP1206]
C288  47uF, 10V  [CAP1206]
C289  47uF, 10V  [CAP1206]
C290  1uF, 10V  [CAP0402]
C291  1nF, 50V  [CAP0402]
C292  100nF, 100V  [CAP0805]
C293  1uF, 25V  [CAP0603]
C294  100nF, 100V  [CAP0805]
C295  4.7nF, 50V  [CAP0402]
C296  470pF, 50V  [CAP0402]
C297  1000pF, 2kV  [CAP1812]
C298  22uF, 10V  [CAP0603]
C299  22uF, 10V  [CAP0603]
C300  22uF, 10V  [CAP0603]
C301  22uF, 10V  [CAP0603]
C302  4.7uF, 6.3V  Assembly Info: NF  [CAP0402]
C303  4.7uF, 6.3V  Assembly Info: NF  [CAP0402]
C304  4.7uF, 6.3V  [CAP0402]
C305  4.7uF, 6.3V  [CAP0402]
C306  470pF, 50V  [CAP0402]
C307  470pF, 50V  [CAP0402]
C308  4.7uF, 6.3V  [CAP0402]
C309  4.7uF, 6.3V  [CAP0402]
C310  4.7uF, 6.3V  [CAP0402]
C311  4.7uF, 6.3V  [CAP0402]
C312  22uF, 10V  [CAP0603]
C313  22uF, 10V  [CAP0603]
C314  10uF, 6.3V  [CAP0603]
C315  470pF, 50V  [CAP0402]
D1  STTH302S  [STTH302S_diode]
D2  STPS1H100A  [STPS1H100A_shottky_diode]
D3  BAT46J  [BAT46JFILM_shottky_diode_SOD323]
D4  TS431AILT  [SOT23-5]
F1  Fiducial  [Fiducial]  (value not drawn)
F2  Fiducial  [Fiducial]  (value not drawn)
F3  Fiducial  [Fiducial]  (value not drawn)
F4  Fiducial  [Fiducial]  (value not drawn)
F5  Fiducial  [Fiducial]  (value not drawn)
F6  Fiducial  [Fiducial]  (value not drawn)
F7  Fiducial  [Fiducial]  (value not drawn)
F8  Fiducial  [Fiducial]  (value not drawn)
FR47  600R, 2A  Assembly Info: NF  [RES0805]
FR48  600R, 2A  [RES0805]
FR49  600R, 2A  [RES0805]
FR50  600R, 2A  [RES0805]
FR51  600R, 2A  [RES0805]
IC34  PM8800A  [PM8800A_HTSSOP16]
IC35  LMZ10501  [LMZ10501]
IC36  LMZ10501  [LMZ10501]
IC37  AP7361-FGE  Assembly Info: NF  [AP7361]
IC38  AP7361-FGE  [AP7361]
IC39  AP7361-FGE  [AP7361]
IC40  AP7361-FGE  [AP7361]
IC41  LMZ10501  [LMZ10501]
J26  CONN_PWR_JACK_2.1x5.5mm  [CONN_PWR_JACK_v2]  (value not drawn)
J27  Assembly Info: NF  [HDR_1x2_NO_SILK]
J28  PWR_SEL  Assembly Info: NF  [HDR_1x3_NO_SILK]
L2  3.3uH, 2A  [NRS4018T3R3MDGJ_inductor]
L3  0.33uH, 7.5A  [PA4336.331NLT_inductor]
MECH5  # pcs.  [PCB_standoff]  (value not drawn)
MECH6  # pcs.  [PCB_standoff]  (value not drawn)
MECH7  # pcs.  [PCB_standoff]  (value not drawn)
MECH8  # pcs.  [PCB_standoff]  (value not drawn)
R208  10R, 5%  [RES0402]
R209  88.7k, 1%  [RES0402]
R210  10k, 1%  [RES0402]
R211  0R  Assembly Info: NF  [RES0402]
R212  33k, 1%  [RES0402]
R213  0R  [RES0402]
R214  52.3R, 1%  [RES0805]
R215  15k, 1%  [RES0402]
R216  10k, 1%  [RES0402]
R217  15k, 1%  [RES0402]
R218  330k, 1%  [RES0402]
R219  10R, 5%  [RES0402]
R220  10R, 5%  [RES0402]
R221  10R, 5%  [RES0402]
R222  21k, 1%  [RES0402]
R223  1k, 1%  [RES0402]
R224  0R  [RES0805]
R225  10R, 5%  [RES0402]
R226  1k, 1%  [RES0402]
R227  10k, 1%  [RES0402]
R228  100R, 1%  [RES0402]
R229  0R  [RES0402]
R230  10k, 1%  [RES0402]
R231  0.47R  [RES0805]
R232  0.47R  [RES0805]
R233  15k, 1%  [RES0402]
R234  12.4k, 1%  [RES0402]
R235  1k, 1%  Assembly Info: NF  [RES0402]
R236  560R, 1%  [RES0402]
R237  118k, 1%  [RES0402]
R238  118k, 1%  [RES0402]
R239  470R, 0.5%  Assembly Info: NF  [RES0402]
R240  1k, 1%  [RES0402]
R241  150k, 1%  [RES0402]
R242  150k, 1%  [RES0402]
R243  1.6k, 1%  [RES0402]
R244  750R, 1%  [RES0402]
R245  0R  [RES0402]
R246  510R, 1%  [RES0402]
R247  1k, 1%  [RES0402]
R248  187k, 1%  [RES0402]
R249  82.5k, 1%  [RES0402]
R250  0R  Assembly Info: NF  [RES0805]
R251  0R  Assembly Info: NF  [RES0805]
T5  Flyback transformer PoE13P-50L  [PoE13P-50L_Flyback_transformer]
VD3  SMAJ58A  [SMAJ58A_shottky_diode]
VD4  BZX84C15W  [SOT323]
VD5  STPS15L30C  [STPS15L30C_shottky_rectifier_DPAK]
VD6  SMAJ58A  [SMAJ58A_shottky_diode]
VD7  SMBJ5V0A  Assembly Info: NF  [SMAJ12CA-13-F]
VT8  STS10N3LH5  [STS10P3LLH6_PMOS_SO8]
VT9  STD5N20LT4  [STD5N20LT4_NMOS_DPAK]

### Nets
GND: C279.1 C286.1 C287.1 C288.1 C289.1 C290.1 C297.1 C298.1 C299.1 C300.1 C301.1 C302.1 C303.1 C304.1 C305.1 C306.2 C307.2 C308.1 C309.1 C310.1 C311.1 C312.1 C313.1 C314.1 C315.2 D4.5(Anode) IC35.4(SGND) IC35.6(PGND) IC35.PAD(PAD_(SGND)) IC36.4(SGND) IC36.6(PGND) IC36.PAD(PAD_(SGND)) IC37.4(GND) IC37.9(PAD) IC38.4(GND) IC38.9(PAD) IC39.4(GND) IC39.9(PAD) IC40.4(GND) IC40.9(PAD) IC41.4(SGND) IC41.6(PGND) IC41.PAD(PAD_(SGND)) J27.1 MECH5.MH1 MECH6.MH1 MECH7.MH1 MECH8.MH1 R233.1 R234.1 R239.2 R240.1 R241.1 R242.1 R246.2 R247.1 R249.1 T5.9 T5.10 VD7.A
POE_AGND: AT1.3(Emitter) C270.1 C276.1 C294.1 IC34.16(AGND) R209.1 R229.2
POE_GND: C272.2 C277.1 C280.1 C281.1 C282.1 C283.1 C284.1 C285.1 C293.1 C296.2 C297.2 IC34.9(GND) R230.2 R231.2 R232.2 T5.1 VT8.5(D) VT8.6(D) VT8.7(D) VT8.8(D)
POE_VIN: BR1.1(V+) BR2.1(V+) C274.2 C280.2 C281.2 C282.2 C283.2 D1.C L2.1 R208.2 VD3.A
POE_VSS: BR1.2(V-) BR2.2(V-) C271.1 C274.1 C275.1 C277.2 IC34.8(VSS) IC34.17(GPAD) R214.2 R217.2 VD3.K
VCC1P4_LMS: C311.2 IC40.1(OUT) R244.1
VCC1P8: C313.2 FR51.1 IC41.3(FB) IC41.5(VOUT)
VCC1P8_LMS: C314.2 FR48.1 FR50.1 FR51.2
VCC1P25_LMS: C305.2 IC38.1(OUT) R236.2
VCC2P5: C303.2 IC37.1(OUT) R235.2
VCC3P3: C299.2 IC35.3(FB) IC35.5(VOUT) R245.1 R250.2 R251.2
VCC3P3_2: C301.2 IC36.3(FB) IC36.5(VOUT) R250.1
VCC3P3_CLK: C309.2 IC39.1(OUT) R243.2 R251.1
VCC5P0: C298.2 C300.2 C312.2 FR47.1 FR49.1 IC35.7(VIN) IC36.7(VIN) IC41.7(VIN) J27.2 J28.2 R224.1 VD7.K
VCC5P0_POE: C279.2 C287.2 C288.2 C289.2 J28.1 L3.2 R221.1 R222.2 R224.2
VCC5P0_USB_EXT: J28.3
POE1_DC+: BR1.3(AC)
POE1_DC-: BR1.4(AC)
POE2_DC+: BR2.3(AC)
POE2_DC-: BR2.4(AC)
POE_AUXII: IC34.3(AUXII) R210.2
POE_COMP: AT1.4(Collector) IC34.14(COMP) R223.2
POE_CS: C296.1 IC34.13(CS) R228.1
POE_GD: IC34.10(GD) R225.1
POE_NPGD: C276.2 IC34.12(nPGD) R216.1
POE_VCC: C293.2 C294.2 D3.C IC34.11(VCC) R216.2
POE_VFB: C292.1 IC34.15(VFB) R229.1
NetAT1_1: AT1.1(Anode) C290.2 R221.2
NetAT1_2: AT1.2(Cathode) R226.2
NetC270_2: C270.2 IC34.2(SS)
NetC271_2: C271.2 IC34.4(VIN) R208.1
NetC272_1: C272.1 D1.A J26.1 R210.1 R211.1 R212.1 R215.2
NetC273_1: C273.1 J26.2 J26.3 R215.1 R218.2 VD4.1(A) VT8.1(S) VT8.2(S) VT8.3(S)
NetC273_2: C273.2 R212.2 R213.1 R218.1 VT8.4(G)
NetC275_2: C275.2 IC34.6(AUXI_IRL)
NetC278_1: C278.1 R219.2
NetC278_2: C278.2 C286.2 L3.1 VD5.4(C)
NetC284_2: C284.2 C285.2 L2.2 T5.3 VD6.K
NetC291_1: C291.1 D4.4(Reference) R222.1 R227.2 R233.2 R234.2
NetC291_2: C291.2 C295.2 D4.3(Cathode) R226.1
NetC292_2: C292.2 R223.1
NetC295_1: C295.1 R227.1
NetC302_2: C302.2 FR47.2 IC37.5(EN) IC37.8(IN)
NetC304_2: C304.2 FR48.2 IC38.5(EN) IC38.8(IN)
NetC306_1: C306.1 IC35.2(VCON) R237.1 R241.2
NetC307_1: C307.1 IC36.2(VCON) R238.1 R242.2
NetC308_2: C308.2 FR49.2 IC39.5(EN) IC39.8(IN)
NetC310_2: C310.2 FR50.2 IC40.5(EN) IC40.8(IN)
NetC315_1: C315.1 IC41.2(VCON) R248.1 R249.2
NetD2_A: D2.A T5.4 VT9.4(D)
NetD2_C: D2.C VD6.A
NetD3_A: D3.A R220.1
NetIC34_1: IC34.1(RT) R209.2
NetIC34_5: IC34.5(RCLASS) R214.1
NetIC34_7: IC34.7(DCCL) R217.1
NetIC35_8: IC35.8(VREF) R237.2
NetIC36_8: IC36.8(VREF) R238.2
NetIC37_3: IC37.3(ADJ/NC) R235.1 R239.1
NetIC38_3: IC38.3(ADJ/NC) R236.1 R240.2
NetIC39_3: IC39.3(ADJ/NC) R243.1 R246.1
NetIC40_3: IC40.3(ADJ/NC) R244.2 R247.2
NetIC41_1: IC41.1(EN) R245.2
NetIC41_8: IC41.8(VREF) R248.2
NetR211_2: R211.2 R213.2 VD4.3(C)
NetR219_1: R219.1 T5.7 T5.8 VD5.1(A1) VD5.3(A2)
NetR220_2: R220.2 T5.2
NetR225_2: R225.2 R230.1 VT9.1(G)
NetR228_2: R228.2 R231.1 R232.1 VT9.3(S)

Not connected (* = marked no-connect by the designer): D4 1(NC)* 2(NC)*; F1 1*; F2 1*; F3 1*; F4 1*; F5 1*; F6 1*; F7 1*; F8 1*; IC35 1(EN)*; IC36 1(EN)*; IC37 2(NC)* 6(NC)* 7(NC)*; IC38 2(NC)* 6(NC)* 7(NC)*; IC39 2(NC)* 6(NC)* 7(NC)*; IC40 2(NC)* 6(NC)* 7(NC)*

### Layout directives
net class VCC1P4_LMS: VCC1P4_LMS
net class VCC1P25_LMS: VCC1P25_LMS
net class VCC1P8_LMS: VCC1P8_LMS
net class VCC3P3_CLK: VCC3P3_CLK
net class VCC2P5: VCC2P5
net class VCC3P3_2: VCC3P3_2
net class POE_VIN: POE_VIN
net class VCC5P0_POE: VCC5P0_POE
net class VCC3P3: VCC3P3
net class VCC1P8: VCC1P8
net class VCC5P0: VCC5P0

### Notes on the sheet
- NF elements on sheet: R211, J27, VD7, FR47, C302, IC37, R235, R239, C303, R250, R251, C280, C281, J28
- Number of NF elements on sheet: 14
- Total number of NF elements on all sheets: 82
- Board power circuits
- Power over Ethernet
- (near R210) External supply
- IEEE 802.3af compliant
- (near BR1) Class 3 (6.49-12.95W) Mid power
- (near J26) Positive polarity
- External power supply
- (near J26) 12-30V limited power output
- 30-60V full power output
- (near R211) NF
- (near C280) NF
- (near C281) NF
- Power source selection (5V)
- (near J28) NF
- (near J27) NF
- (near VD7) NF
- PWR_SEL:
- 1-2 shorted: board is powered from Poe or external PS (12-60V)
- 2-3 shorted: board is powered from Micro USB (5V)
- Switching regulators
- (near IC35) FPGA, Periphs
- ERC rule exception:
- VCC3P3 connected to power and I/O pins
- (near IC36) ETH, RAPI, FTDI, WIFI
- Linear regulators
- Linear regulators (LMS)
- (near FR47) NF
- (near C303) NF
- RT
- (near C307) RB
- (near IC36) ERC rule exception:
- (near IC36) VCC3P3_2 connected to power and I/O pins
- (near C302) NF
- (near IC37) NF
- (near R235) NF
- (near R239) NF
- Fiducials
- PCB standoffs
- (near R251) NF
- (near R250) NF
- VCC3P3_CLK connected to power and I/O pins
- Top
- (near F5) Bottom
- Project name:
- Title:
- Size:
- Date:
- A3
- Revision:
- Time:
- Sheet
- of
- File:
- (in symbol PoE13P-50L_Flyback_transformer_1) Pri; Sec; Aux